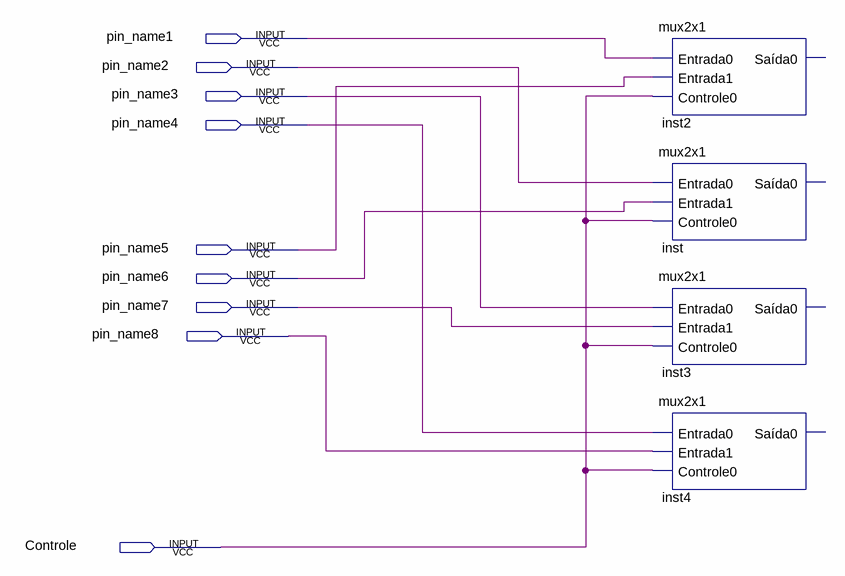
[diagram p0: schematic sheet]
// Quartus schematic Multiplexador2x1Barreamento4bits.bdf as structural Verilog: 4 symbols, 9 pins
module Multiplexador2x1Barreamento4bits (
  input  pin_name1,
  input  pin_name2,
  input  pin_name3,
  input  pin_name4,
  input  pin_name5,
  input  pin_name6,
  input  pin_name7,
  input  pin_name8,
  input  Controle
);

  mux2x1 inst2 (.Entrada0(pin_name1), .Entrada1(pin_name5), .Controle0(Controle));  // open: Saída0
  mux2x1 inst (.Entrada0(pin_name2), .Entrada1(pin_name6), .Controle0(Controle));  // open: Saída0
  mux2x1 inst3 (.Entrada0(pin_name3), .Entrada1(pin_name7), .Controle0(Controle));  // open: Saída0
  mux2x1 inst4 (.Entrada0(pin_name4), .Entrada1(pin_name8), .Controle0(Controle));  // open: Saída0
endmodule
